# Altium project ICAN-7006-AiUi.PrjPCB
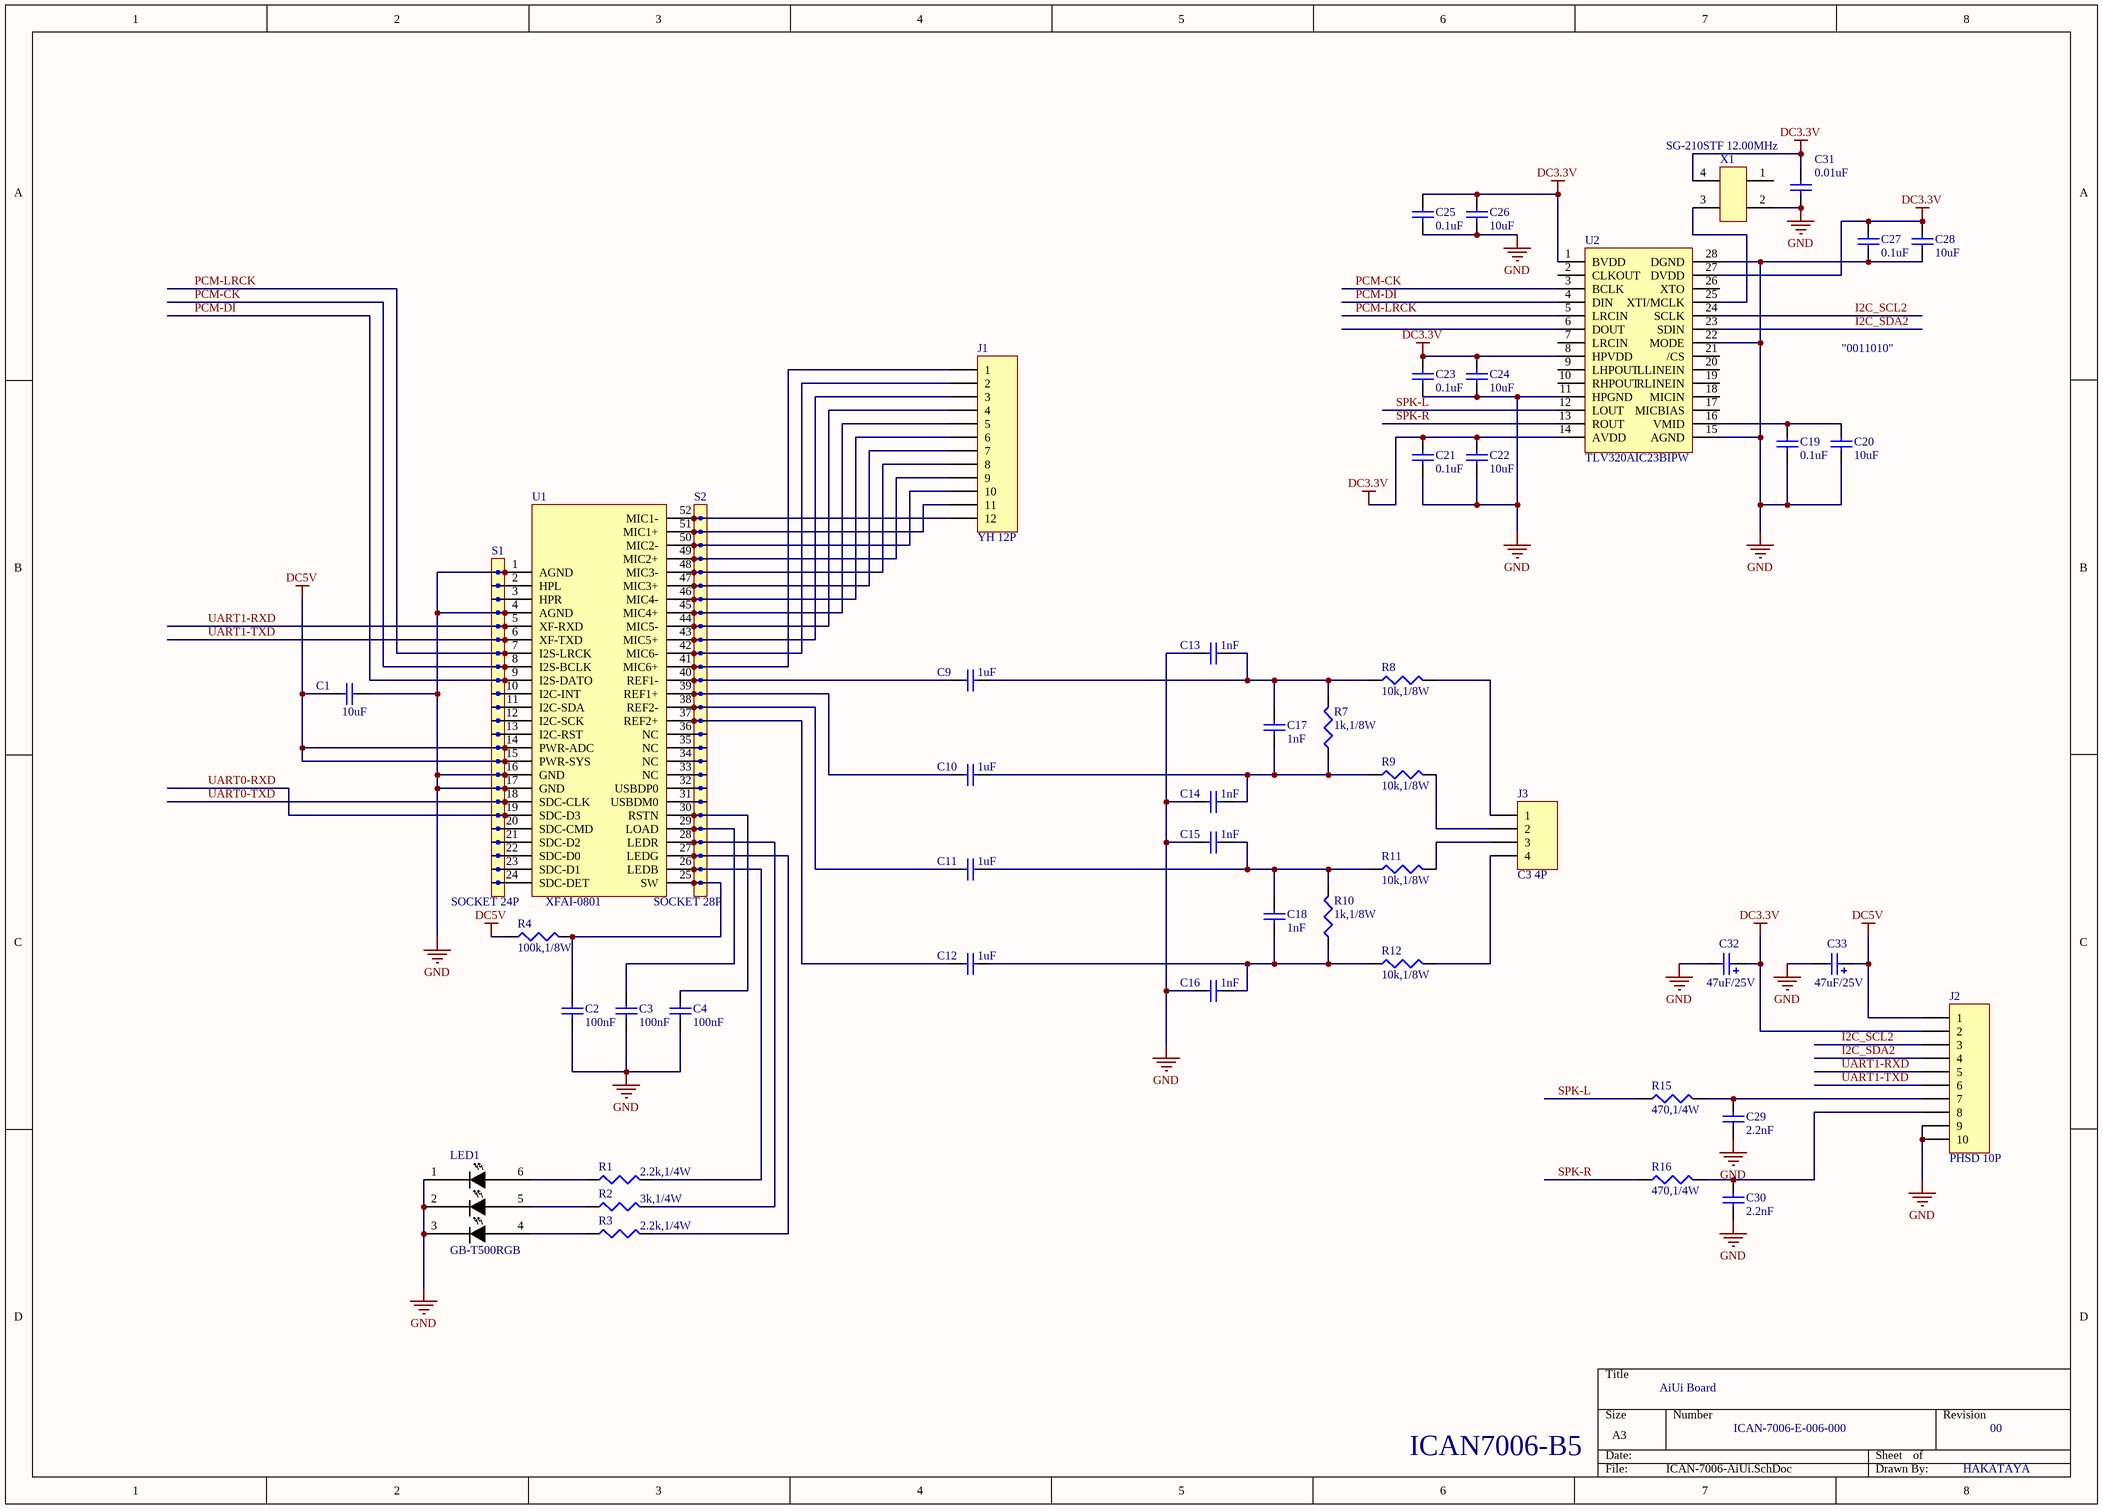
[diagram p0: ICAN-7006-AiUi.SchDoc]
1 sheet, 50 parts. Net scope: global (net labels, ports and power ports of the same name join across sheets).
Board file: ICAN-7006-AiUi.PcbDoc

## Sheet ICAN-7006-AiUi.SchDoc
size A3; PageSetup: Record=PageOptions|CenterHorizontal=True|CenterVertical=True|PrintScale=1.04|XCorrection=1.00|YCorrection=1.00|PrintKind=0|BorderSize=5000000|LeftOffset=0|BottomOffset=0|Orientation=2|PaperLength=1000|PaperWidth=1000|Scale=100|PaperSource=7|PrintQuality=-4|MediaType=1|DitherType=10|PaperKind=A3|PrintScaleMode=1

### Parts
C1  10uF  [[0805]2012]
C2  100nF  [[0805]2012]
C3  100nF  [[0805]2012]
C4  100nF  [[0805]2012]
C9  1uF  [[0805]2012]
C10  1uF  [[0805]2012]
C11  1uF  [[0805]2012]
C12  1uF  [[0805]2012]
C13  1nF  [[0805]2012]
C14  1nF  [[0805]2012]
C15  1nF  [[0805]2012]
C16  1nF  [[0805]2012]
C17  1nF  [[0805]2012]
C18  1nF  [[0805]2012]
C19  0.1uF  [[0805]2012]
C20  10uF  [[0805]2012]
C21  0.1uF  [[0805]2012]
C22  10uF  [[0805]2012]
C23  0.1uF  [[0805]2012]
C24  10uF  [[0805]2012]
C25  0.1uF  [[0805]2012]
C26  10uF  [[0805]2012]
C27  0.1uF  [[0805]2012]
C28  10uF  [[0805]2012]
C29  2.2nF  [[0805]2012]
C30  2.2nF  [[0805]2012]
C31  0.01uF  [[0805]2012]
C32  47uF/25V  [Capa MH5 PITCH2.5mm]
C33  47uF/25V  [Capa MH5 PITCH2.5mm]
J1  YH 12P  [HY-12AW]
J2  PHSD 10P  [PHSD WV05x2]
J3  C3 4P  [C3-S4]
LED1  GB-T500RGB  [LED SMD RGB]
R1  2.2k,1/4W  [[0805]2012]
R2  3k,1/4W  [[0805]2012]
R3  2.2k,1/4W  [[0805]2012]
R4  100k,1/8W  [[0805]2012]
R7  1k,1/8W  [[0805]2012]
R8  10k,1/8W  [[0805]2012]
R9  10k,1/8W  [[0805]2012]
R10  1k,1/8W  [[0805]2012]
R11  10k,1/8W  [[0805]2012]
R12  10k,1/8W  [[0805]2012]
R15  470,1/4W  [[0805]2012]
R16  470,1/4W  [[0805]2012]
S1  SOCKET 24P  [CONN 2.0mm X 24]
S2  SOCKET 28P  [CONN 2.0mm X 28]
U1  XFAI-0801  [XFAI-0801]
U2  TLV320AIC23BIPW  [PW 28p]
X1  SG-210STF 12.00MHz  [XTAL SPXO]

### Nets
DC3.3V: C21.2 C22.2 C23.2 C24.2 C25.2 C26.2 C27.2 C28.2 C31.2 C32.1 J2.2 U2.1(BVDD) U2.8(HPVDD) U2.14(AVDD) U2.27(DVDD) X1.4(Vcc)
DC5V: C1.1 C33.1 J2.1 R4.1 S1.14 S1.15 U1.14(PWR-ADC) U1.15(PWR-SYS)
GND: C1.2 C2.1 C3.1 C4.1 C13.1 C14.1 C15.1 C16.1 C19.1 C20.1 C21.1 C22.1 C23.1 C24.1 C25.1 C26.1 C27.1 C28.1 C29.1 C30.1 C31.1 C32.2 C33.2 J2.9 J2.10 LED1.1(K1) LED1.2(K2) LED1.3(K3) S1.1 S1.4 S1.16 S1.17 U1.1(AGND) U1.4(AGND) U1.16(GND) U1.17(GND) U2.11(HPGND) U2.15(AGND) U2.22(MODE) U2.28(DGND) X1.2(GND)
I2C_SCL2: J2.3 U2.24(SCLK)
I2C_SDA2: J2.4 U2.23(SDIN)
PCM-CK: S1.8 U1.8(I2S-BCLK) U2.3(BCLK)
PCM-DI: S1.9 U1.9(I2S-DATO) U2.4(DIN)
PCM-LRCK: S1.7 U1.7(I2S-LRCK) U2.5(LRCIN)
SPK-L: R15.1 U2.12(LOUT)
SPK-R: R16.1 U2.13(ROUT)
UART0-RXD: S1.19 U1.19(SDC-D3)
UART0-TXD: S1.18 U1.18(SDC-CLK)
UART1-RXD: J2.5 S1.5 U1.5(XF-RXD)
UART1-TXD: J2.6 S1.6 U1.6(XF-TXD)
NetC2_2: C2.2 R4.2 S2.28 U1.25(SW)
NetC3_2: C3.2 S2.24 U1.29(LOAD)
NetC4_2: C4.2 S2.23 U1.30(RSTN)
NetC9_1: C9.1 S2.13 U1.40(REF1-)
NetC9_2: C9.2 C13.2 C17.2 R7.2 R8.1
NetC10_1: C10.1 S2.14 U1.39(REF1+)
NetC10_2: C10.2 C14.2 C17.1 R7.1 R9.1
NetC11_1: C11.1 S2.15 U1.38(REF2-)
NetC11_2: C11.2 C15.2 C18.2 R10.2 R11.1
NetC12_1: C12.1 S2.16 U1.37(REF2+)
NetC12_2: C12.2 C16.2 C18.1 R10.1 R12.1
NetC19_2: C19.2 C20.2 U2.16(VMID)
NetC29_2: C29.2 J2.7 R15.2
NetC30_2: C30.2 J2.8 R16.2
NetJ1_1: J1.1 S2.12 U1.41(MIC6+)
NetJ1_2: J1.2 S2.11 U1.42(MIC6-)
NetJ1_3: J1.3 S2.10 U1.43(MIC5+)
NetJ1_4: J1.4 S2.9 U1.44(MIC5-)
NetJ1_5: J1.5 S2.8 U1.45(MIC4+)
NetJ1_6: J1.6 S2.7 U1.46(MIC4-)
NetJ1_7: J1.7 S2.6 U1.47(MIC3+)
NetJ1_8: J1.8 S2.5 U1.48(MIC3-)
NetJ1_9: J1.9 S2.4 U1.49(MIC2+)
NetJ1_10: J1.10 S2.3 U1.50(MIC2-)
NetJ1_11: J1.11 S2.2 U1.51(MIC1+)
NetJ1_12: J1.12 S2.1 U1.52(MIC1-)
NetJ3_1: J3.1 R8.2
NetJ3_2: J3.2 R9.2
NetJ3_3: J3.3 R11.2
NetJ3_4: J3.4 R12.2
NetLED1_4: LED1.4(A3) R3.1
NetLED1_5: LED1.5(A2) R2.1
NetLED1_6: LED1.6(A1) R1.1
NetR1_2: R1.2 S2.27 U1.26(LEDB)
NetR2_2: R2.2 S2.25 U1.28(LEDR)
NetR3_2: R3.2 S2.26 U1.27(LEDG)
NetS1_2: S1.2 U1.2(HPL)
NetS1_3: S1.3 U1.3(HPR)
NetS1_10: S1.10 U1.10(I2C-INT)
NetS1_11: S1.11 U1.11(I2C-SDA)
NetS1_12: S1.12 U1.12(I2C-SCK)
NetS1_13: S1.13 U1.13(I2C-RST)
NetS1_20: S1.20 U1.20(SDC-CMD)
NetS1_21: S1.21 U1.21(SDC-D2)
NetS1_22: S1.22 U1.22(SDC-D0)
NetS1_23: S1.23 U1.23(SDC-D1)
NetS1_24: S1.24 U1.24(SDC-DET)
NetS2_17: S2.17 U1.36(NC)
NetS2_18: S2.18 U1.35(NC)
NetS2_19: S2.19 U1.34(NC)
NetS2_20: S2.20 U1.33(NC)
NetS2_21: S2.21 U1.32(USBDP0)
NetS2_22: S2.22 U1.31(USBDM0)
NetU2_25: U2.25(XTI/MCLK) X1.3(OUT)

Not connected (* = marked no-connect by the designer): U2 2(CLKOUT) 6(DOUT) 7(LRCIN) 9(LHPOUT) 10(RHPOUT) 17(MICBIAS) 18(MICIN) 19(RLINEIN) 20(LLINEIN) 21(/CS) 26(XTO); X1 1(*ST)

### Notes on the sheet
- "0011010"
- AiUi Board
- ICAN7006-B5
- ICAN-7006-E-006-000
- 00
- HAKATAYA

### Library data of the parts
C1-C4 C9-C30 = Cap Semi: Capacitor; Published: 8-Jun-2000; LatestRevisionDate: 17-Jul-2002; LatestRevisionNote: Re-released for DXP Platform.; PackageReference: C1206; Publisher: Altium Limited
  C1 C20 C22 C24 C26 C28: Value: 10uF
  C2-C4: Value: 100nF
  C9-C12: Value: 1uF
  C13-C18: Value: 1nF
  C19 C21 C23 C25 C27: Value: 0.1uF
  C29 C30: Value: 2.2nF
C31 = Cap Semi: Capacitor (Semiconductor SIM Model); Published: 8-Jun-2000; LatestRevisionDate: 17-Jul-2002; LatestRevisionNote: Re-released for DXP Platform.; PackageReference: C1206; Publisher: Altium Limited; Value: 0.01uF
C32 C33 = Cap Pol2: Polarized Capacitor (Axial); Published: 8-Jun-2000; LatestRevisionDate: 17-Jul-2002; LatestRevisionNote: Re-released for DXP Platform.; PackageReference: POLAR0.8; Publisher: Altium Limited; Value: 47uF/25V; Supplier Part Number: MH5 47uF/25V
J1 = Header 12: Header, 12-Pin; Value: A2006-12A; LatestRevisionDate: 17-Jul-2002; LatestRevisionNote: Re-released for DXP Platform.; Publisher: Altium Limited; Supplier Part Number: A2006-12A; Supplier: YOLINK
J2 = Header 10: Header, 10-Pin; LatestRevisionDate: 17-Jul-2002; LatestRevisionNote: Re-released for DXP Platform.; Publisher: Altium Limited; Supplier Part Number: A2006-WV05X2; Supplier: YOLINK
J3 = Header 4: Header, 4-Pin; LatestRevisionDate: 17-Jul-2002; LatestRevisionNote: Re-released for DXP Platform.; Publisher: Altium Limited
LED1 = LED Tri-COLOR: LED RGB; URL: https://item.taobao.com/item.htm?id=528315956353&ali_trackid=2:mm_121791806_21994248_75072884:1521796069_369_1317164216&spm=a231o.7712113%2Fe.1004.404&pvid=200_11.224.194.67_451151_1521796043550; Supplier Part Number: GB-T500RGB
R1-R4 R7-R12 R15 R16 = Res3: Resistor; Published: 8-Jun-2000; LatestRevisionDate: 04-Mar-2005; LatestRevisionNote: PCB Footprint replaced.; PackageReference: J1-0603; Publisher: Altium Limited
  R1 R3: Value: 2.2k,1/4W
  R2: Value: 3k,1/4W
  R4: Value: 100k,1/8W
  R7 R10: Value: 1k,1/8W
  R8 R9 R11 R12: Value: 10k,1/8W
  R15 R16: Value: 470,1/4W
S1 = SOCKET 24P: IC SOCKET; URL: https://item.taobao.com/item.htm?id=542917893128&ali_trackid=2:mm_121791806_21994248_75072884:1521806862_213_381946262&spm=a231o.7712113%2Fe.1004.1271&pvid=200_11.228.16.128_345826_1521806551379
S2 = SOCKET 28P: IC SOCKET; URL: https://item.taobao.com/item.htm?id=542917893128&ali_trackid=2:mm_121791806_21994248_75072884:1521806862_213_381946262&spm=a231o.7712113%2Fe.1004.1271&pvid=200_11.228.16.128_345826_1521806551379
U1 = XFAI-0801: AiUI; Value: XFAI-0801
U2 = IC28: DAC; Value: TLV320AIC23BIPW
X1 = IC4: Crystal oscilator; Value: SG-210STF 12.00MHz